# EAGLE design simple-temp-toggle (EAGLE 7.7.0)
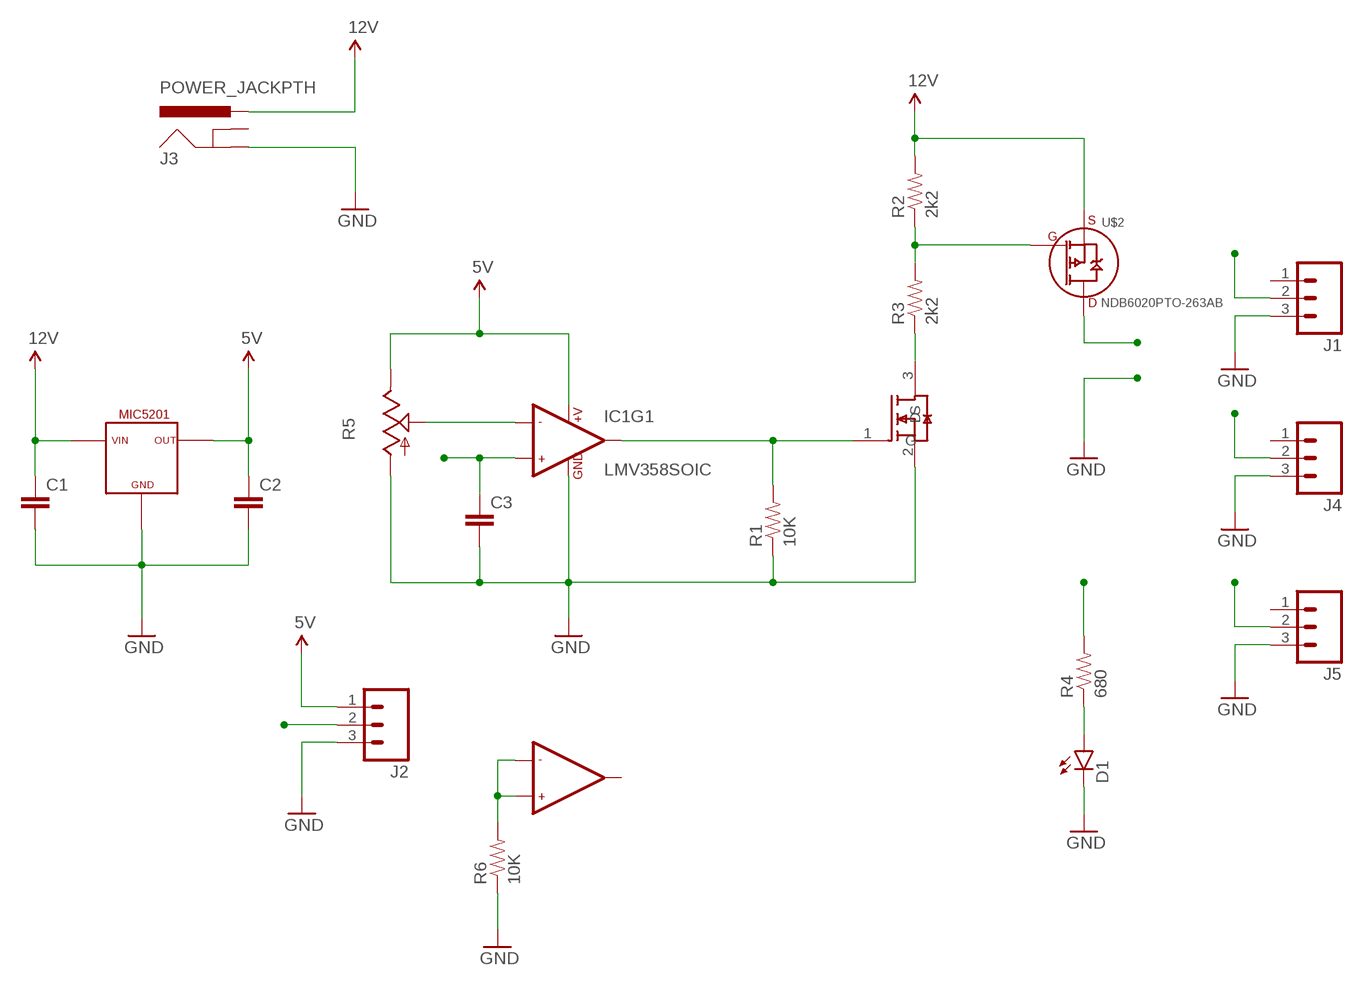
[diagram p0: schematic, sheet 1]

## Parts
C1  2.2UF50V10%(1206)  [1206-CAP]
C2  2.2UF50V10%(1206)  [1206-CAP]
C3  2.2UF50V10%(1206)  [1206-CAP]
D1  LED-FKIT-1206  [FKIT-LED-1206]
IC1  LMV358SOIC  [SO08]
J1  M03LONGPADS  [1X03_LONGPADS]
J2  M03LONGPADS  [1X03_LONGPADS]
J3  POWER_JACKPTH  [POWER_JACK_PTH]
J4  M03LONGPADS  [1X03_LONGPADS]
J5  M03LONGPADS  [1X03_LONGPADS]
R1  10K  RESISTOR1206  [1206]
R2  2k2  RESISTOR1206  [1206]
R3  2k2  RESISTOR1206  [1206]
R4  680  RESISTOR1206  [1206]
R5  TRIM_US-S64W  [S64W]
R6  10K  RESISTOR1206  [1206]
U$2  NDB6020PTO-263AB  [TO-263AB]
U$3  MIC5201SOT-223  [SOT-223]
U$4  DMG2302UKSOT-23-3  [SOT-23-3]

## Nets
5V: C2.1 IC1.8(+V) J2.1 R5.E U$3.3(OUT)
12V: C1.1 J3.PWR R2.2 U$2.3(S) U$3.1(IN)
FAN_CTRL: IC1.1(OUT1) R1.2 U$4.1(G)
FAN_PWR: J1.2 J4.2 J5.2 R4.2 U$2.4(D)
GND: C1.2 C2.2 C3.2 D1.C IC1.4(GND) J1.3 J2.3 J3.GND J4.3 J5.3 R1.1 R5.A R6.1 U$3.2(GND) U$4.2(S)
N$1: IC1.2(-IN1) R5.S
N$2: IC1.5(+IN2) IC1.6(-IN2) R6.2
N$3: D1.A R4.1
N$4: R2.1 R3.2 U$2.1(G)
N$5: R3.1 U$4.3(D)
TMP_SENSOR: C3.1 IC1.3(+IN1) J2.2
Unconnected: IC1.7(OUT2) J1.1 J3.GNDBREAK J4.1 J5.1 U$3.4

## Library data of the parts
C1-C3 = SparkFun-Capacitors:2.2UF50V10%(1206): CAP-10009
D1 = SparkFun-LED:LED: LEDs Standard schematic elements and footprints for 5mm, 3mm, 1206, and 0603 sized LEDs. 5mm - Spark Fun Electronics SKU : COM-00529 (and others)
IC1 = SparkFun-AnalogIC:LMV358: Jellybean rail-to-rail output op-amp; PROD_ID: IC-09657
J1 J2 J4 J5 = SparkFun-Connectors:M03: Header 3 Standard 3-pin 0.1" header. Use with straight break away headers (SKU : PRT-00116), right angle break away headers (PRT-00553), swiss pins (PRT-00743), machine pins (PRT-00117), and female headers (PRT-00115). Molex polarized connector foot print use with SKU : PRT-08232 with associated crimp pins and housings.
J3 = SparkFun-Connectors:POWER_JACK: Power Jack This is the standard 5.5mm barrel jack for power. The PTH is the most common, proven, reliable, footprint. The Slot footprint only works if the mill layer is transmitted to the PCB fab house so be warned. Mating wall wart : TOL-00298 (and others); PROD_ID: CONN-08197
R1-R4 R6 = SparkFun-Resistors:RESISTOR: Resistor Basic schematic elements and footprints for 0603, 1206, and PTH resistors.
R5 = pot:TRIM_US-: POTENTIOMETER
U$2 = Synapseware-transistors:NDB6020P: P-Channel Logic Level Enhancement Mode Field Effect Transistor
U$3 = Synapseware-transistors:MIC5201: MIC5201-5.0 5V 200mA LDO Regulator
U$4 = Synapseware-transistors:DMG2302UK: DMG2302UK N-Channel LL MOSFET low RDSon (2.5v)

## Board
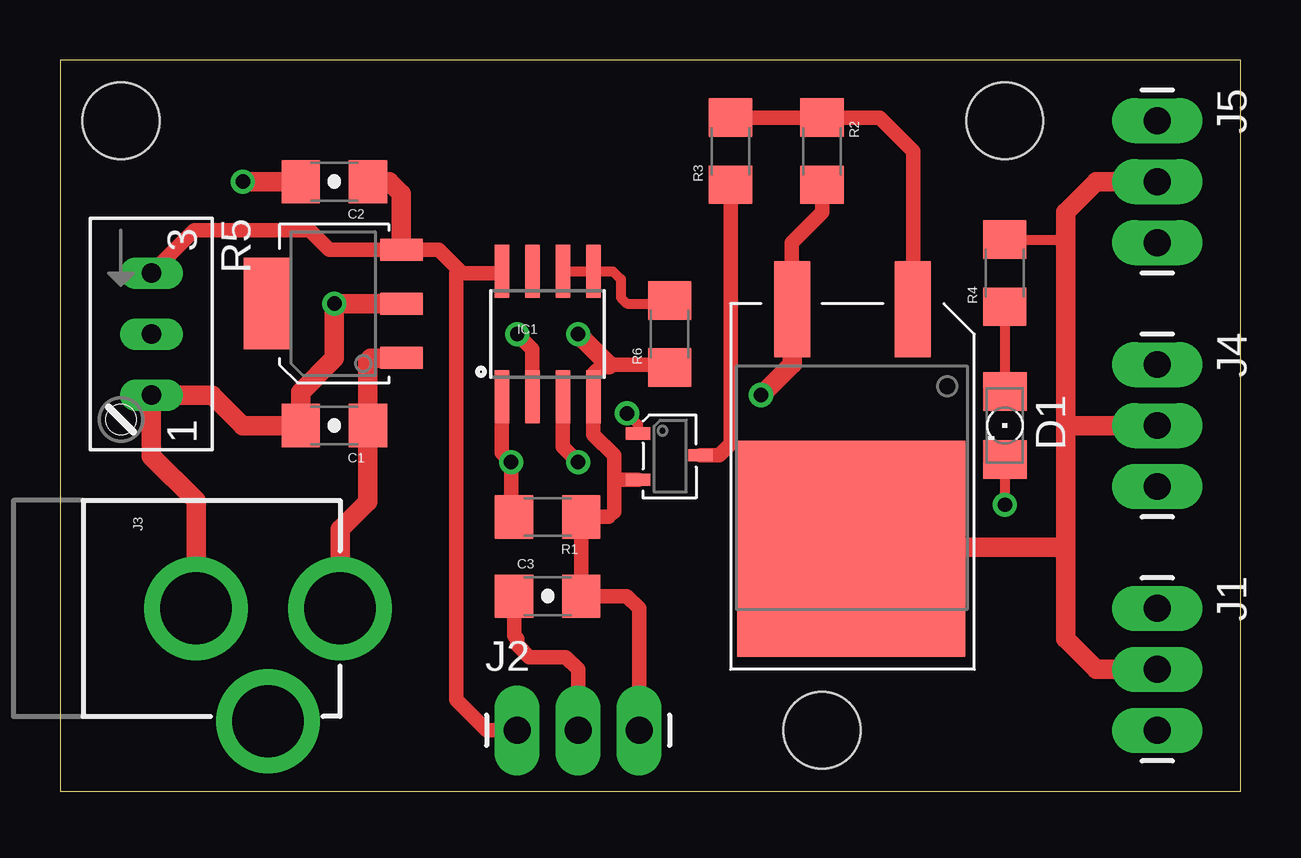
[diagram p1: board, top side]
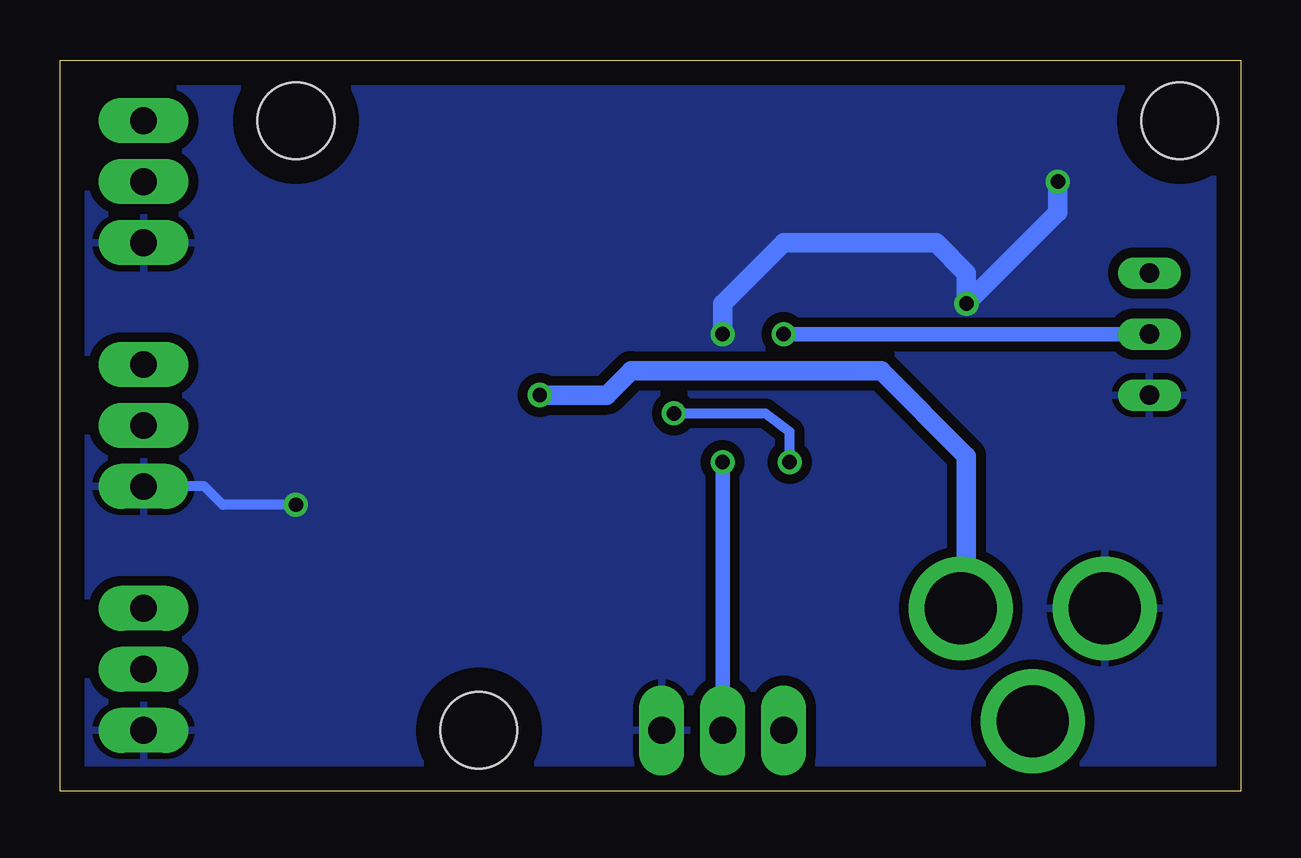
[diagram p2: board, bottom side, seen from below]

Size 49.2 x 30.47 mm. Coordinates in mm from the lower left corner, seen from the top.
Outline: 0,0 49.2,0 49.2,30.47 0,30.47 0,0
Copper layers (1*16): Top 0.035mm / dielectric 1.5mm / Bottom 0.035mm
Design rules "default": minimum track width 10mil, minimum drill 24mil, track to track 8mil, track to pad 8mil, pad to pad 8mil, via to via 8mil, smd to smd 8mil, copper to edge 40mil, drill to drill 8mil, minimum pad ring 10mil, minimum via ring 8mil, stop-mask expansion 4mil, vias tented up to drill 0mil, thermal gap 10mil
Holes 3.2 mm at 39.37,27.94 31.75,2.54 2.54,27.94

### Footprints (pad centres in the part's own frame; a part is rotated, then mirrored left to right if it is on the bottom)
1206-CAP = smd 1.6 x 1.8: 1 -1.4,0; 2 1.4,0
FKIT-LED-1206 = smd 1.6 x 1.803: A -1.422,0; C 1.422,0
SO08 = smd 0.61 x 2.21: 1 -1.905,-2.616; 2 -0.635,-2.616; 3 0.635,-2.616; 4 1.905,-2.616; 5 1.905,2.616; 6 0.635,2.616; 7 -0.635,2.616; 8 -1.905,2.616
1X03_LONGPADS = drill 1.118 pad 1.88 long: 1 0,0; 2 2.54,0; 3 5.08,0
POWER_JACK_PTH = drill 2.997 pad 4.318: GND 0,7.7; GNDBREAK 4.7,10.7; PWR 0,13.7
1206 = smd 1.6 x 1.8: 1 -1.4,0; 2 1.4,0
S64W = drill 0.813 long: A 2.54,1.27; E -2.54,1.27; S 0,1.27
TO-263AB = smd 1.5 x 4: 1 -2.517,-8.652; 3 2.517,-8.652 | smd 9.5 x 9: 4 0.05,1.32
SOT-223 = smd 0.914 x 1.778: 1 -2.25,-2.8; 2 0,-2.8; 3 2.25,-2.8 | smd 3.81 x 1.93: 4 0,2.8
SOT-23-3 = smd 0.508 x 1.016: 1 -0.941,-1.312; 2 0.986,-1.312; 3 -0.03,1.282

### Placement (x,y rotation side)
C1  11.43,15.24 180 top
C2  11.43,25.4 180 top
C3  20.32,8.13 0 top
D1  39.37,15.24 270 top
IC1  20.32,19.05 0 top
J1  45.72,7.62 270 top
J2  19.05,2.54 0 top
J3  -2.03,7.62 270 top
J4  45.72,17.78 270 top
J5  45.72,27.94 270 top
R1  20.32,11.43 180 top
R2  31.75,26.67 270 top
R3  27.94,26.67 90 top
R4  39.37,21.59 90 top
R5  2.54,19.05 270 top
R6  25.4,19.05 90 top
U$2  33.02,11.43 180 top
U$3  11.43,20.32 90 top
U$4  25.4,13.97 270 top

### Tracks (layer width: path | path; a pad name or v marks a point on that pad's centre or on a via)
5V
  Top 0.61: 16.64,21.72 15.78,22.57 U$3.3 11.21,22.57 10.41,23.37 5.59,23.37 R5.E | 16.64,21.72 16.76,21.59 18.34,21.59 IC1.8 | J2.1 17.78,2.54 16.51,3.81 16.51,21.59 16.64,21.72
  Top 0.813: C2.1 13.72,25.4 14.22,24.89 U$3.3
12V  (via drill 0.6)
  Top 0.61: R2.2 31.75,24.13 30.48,22.86 30.48,20.11 U$2.3
  Top 0.813: J3.PWR 11.68,7.64 11.68,10.92 12.83,12.07 C1.1 12.83,17.91 12.95,18.03 14.19,18.03 U$3.1 | U$2.3 30.5,17.8 v29.21,16.51
  Bottom 0.813: v29.21,16.51 26.42,16.51 25.4,17.53 14.99,17.53 11.43,13.97 11.43,7.86 J3.PWR
FAN_CTRL  (via drill 0.6)
  Top 0.406: U$4.1 24.09,15.28 v23.62,15.75
  Top 0.61: IC1.1 18.41,14.1 v18.8,13.72 18.8,11.55 R1.2
  Bottom 0.406: v18.8,13.72 18.8,14.99 19.81,15.75 v23.62,15.75
FAN_PWR
  Top 0.406: R4.2 41.78,22.99 41.91,22.86
  Top 0.813: J1.2 43.18,5.08 41.91,6.35 41.91,10.16 | 41.91,10.16 41.91,15.24 | 41.91,15.24 J4.2 | J5.2 43.18,25.4 41.91,24.13 41.91,22.86 41.91,15.24 | 41.91,10.16 33.02,10.16 U$2.4
GND  (via drill 0.6)
  Top 0.406: D1.C v39.37,11.94
  Top 0.61: R1.1 21.72,11.62 | R1.1 C3.2 23.62,8.13 24.13,7.62 J2.3 | R6.1 25.27,17.78 22.86,17.78 22.61,17.78 22.23,17.4 IC1.4 22.23,14.86 23.08,14 23.08,12.95 | 23.08,12.95 23.08,11.65 22.86,11.43 R1.1 | U$4.2 23.37,12.98 23.08,12.95
  Top 0.813: J3.GND 5.67,12.11 3.81,13.97 R5.A 6.35,16.51 7.62,15.24 C1.2 10.03,16.63 11.43,18.03 v11.43,20.32 U$3.2 | C2.2 v7.62,25.4 | v21.59,19.05 22.86,17.78
  Bottom 0.406: v39.37,11.94 42.42,11.94 43.18,12.7 J4.3
  Bottom 0.813: v21.59,19.05 21.59,20.32 19.05,22.86 12.7,22.86 11.43,21.59 v11.43,20.32 7.62,24.13 v7.62,25.4
  pour Bottom (isolate 0.406): 0,0 49.53,0 49.53,30.48 0,30.48
N$1  (via drill 0.6)
  Top 0.61: IC1.2 19.68,18.41 v19.05,19.05
  Bottom 0.61: v19.05,19.05 R5.S
N$2
  Top 0.406: IC1.6 IC1.5 23.04,21.67 23.37,21.34 23.37,20.57 23.62,20.32 25.27,20.32 R6.2
N$3
  Top 0.406: R4.1 D1.A
N$4
  Top 0.61: R3.2 R2.1 34.16,28.07 35.56,26.67 35.56,20.11 U$2.1
N$5
  Top 0.61: U$4.3 27.46,14 27.94,14.48 R3.1
TMP_SENSOR  (via drill 0.6)
  Top 0.61: C3.1 18.92,6.48 19.05,6.35 19.05,6.1 19.56,5.59 21.08,5.59 21.59,5.08 J2.2 | IC1.3 20.95,14.35 v21.59,13.72
  Bottom 0.61: J2.2 v21.59,13.72